# EAGLE design bbalunlatUFL (EAGLE 5.11)
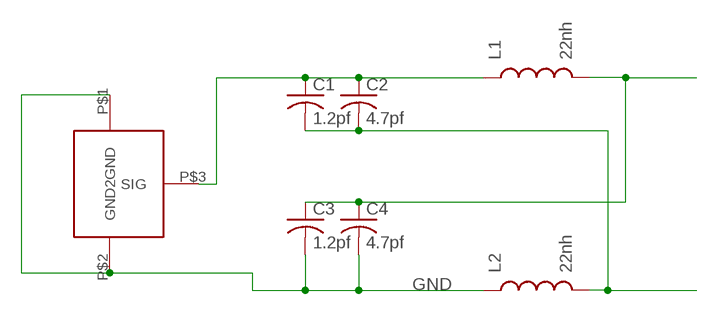
[diagram p0: schematic, sheet 1]

## Parts
C1  1.2pf  C-USC0402  [C0402]
C2  4.7pf  C-USC0402  [C0402]
C3  1.2pf  C-USC0402  [C0402]
C4  4.7pf  C-USC0402  [C0402]
L1  22nh  INDUCTOR0603  [0603]
L2  22nh  INDUCTOR0603  [0603]
U$1  UFL_SMT  [UFL_SMT]

## Nets
GND: C3.2 C4.2 L2.1 U$1.P$1(GND) U$1.P$2(GND2)
N$3: C1.1 C2.1 L1.1 U$1.P$3(SIG)
N$5: C3.1 C4.1 L1.2
N$6: C1.2 C2.2 L2.2

## Library data of the parts
C1-C4 = rcl:C-US: CAPACITOR, American symbol
L1 L2 = SparkFun:INDUCTOR: Inductors Basic Inductor/Choke - 0603 and 1206. Footprints are not proven and vary greatly between part numbers.
U$1 = SUCHAI:UFL_SMT

## Board
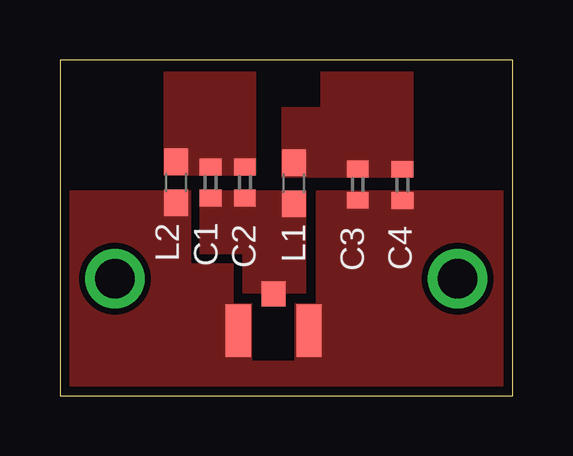
[diagram p1: board, top side]

Size 18.89 x 14.01 mm. Coordinates in mm from the lower left corner, seen from the top.
Outline: 0,0 18.89,0 18.89,14.01 0,14.01 0,0
Copper layers (1*16): Top 0.035mm / dielectric 1.5mm / Bottom 0.035mm
Design rules "default *": minimum track width 10mil, minimum drill 24mil, track to track 10mil, track to pad 10mil, pad to pad 10mil, via to via 10mil, smd to smd 10mil, copper to edge 15mil, drill to drill 8mil, minimum pad ring 10mil, minimum via ring 8mil, stop-mask expansion 4mil, vias tented up to drill 0mil, thermal gap 20mil

### Footprints (pad centres in the part's own frame; a part is rotated, then mirrored left to right if it is on the bottom)
C0402 = smd 0.7 x 0.9: 1 -0.65,0; 2 0.65,0
0603 = smd 1.1 x 1: 1 -0.85,0; 2 0.85,0
UFL_SMT = smd 1.05 x 2.2: P$1 -1.475,0; P$2 1.475,0 | smd 1 x 1.05: P$3 0,-1.525

### Placement (x,y rotation side)
C1  6.28,8.89 90 top
C2  7.72,8.89 90 top
C3  12.41,8.81 270 top
C4  14.28,8.79 270 top
L1  9.76,8.86 90 top
L2  4.85,8.9 90 top
U$1  8.92,2.72 180 top

### Tracks (layer width: path | path; a pad name or v marks a point on that pad's centre or on a via)
GND
  pour Top (no thermals): 10.67,8.56 19.05,8.56 19.05,-0.08 -0.13,-0.08 -0.13,8.56 5.46,8.56 5.46,5.51 7.24,5.51 7.24,3.86 8,3.86 8,1.45 9.78,1.45 9.78,3.86 10.67,3.86
N$1  (via drill 1.65)
  other vias: 2.29,4.88
N$2  (via drill 1.65)
  other vias: 16.59,4.88
N$3
  pour Top (no thermals): 5.82,8.56 10.26,8.56 10.26,5.92 5.82,5.92
  pour Top (no thermals): 7.62,7.11 10.26,7.11 10.26,4.27 7.62,4.27
N$5
  Top 0.305: C4.1 14.27,9.46
  pour Top (no thermals): 10.87,9.09 9.25,9.09 9.25,12.04 11.05,12.04 11.05,9.09
  pour Top (no thermals): 10.87,9.09 14.73,9.09 14.73,13.51 10.87,13.51
N$6
  pour Top (no thermals): 4.32,9.19 8.18,9.19 8.18,13.51 4.32,13.51